# Altium schematic sheet lv_io_temp.SchDoc
size A4; Organization: Badgerloop; Address1: 133 Engineering Research; Address2: Building; Address3: Madison, WI 53715
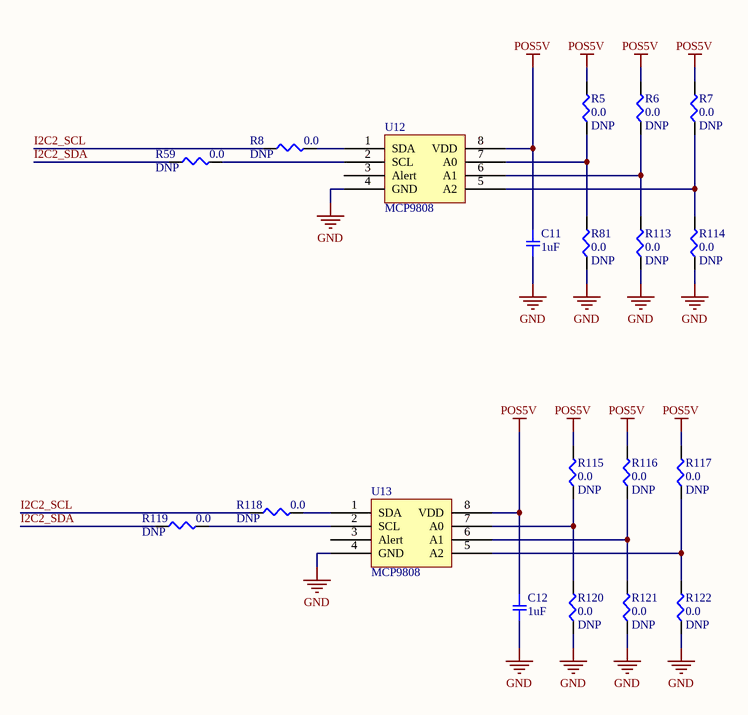
[diagram p0: lv_io_temp.SchDoc]

## Parts
C11  1uF  [SMD-0402C]
C12  1uF  [SMD-0402C]
R5  0.0  [SMD-0402-RES]
R6  0.0  [SMD-0402-RES]
R7  0.0  [SMD-0402-RES]
R8  0.0  [SMD-0402-RES]
R59  0.0  [SMD-0402-RES]
R81  0.0  [SMD-0402-RES]
R113  0.0  [SMD-0402-RES]
R114  0.0  [SMD-0402-RES]
R115  0.0  [SMD-0402-RES]
R116  0.0  [SMD-0402-RES]
R117  0.0  [SMD-0402-RES]
R118  0.0  [SMD-0402-RES]
R119  0.0  [SMD-0402-RES]
R120  0.0  [SMD-0402-RES]
R121  0.0  [SMD-0402-RES]
R122  0.0  [SMD-0402-RES]
U12  MCP9808  [TSOP65P490X65_HS-9N]
U13  MCP9808  [TSOP65P490X65_HS-9N]

## Nets
GND: C11.2 C12.2 R81.1 R113.1 R114.1 R120.1 R121.1 R122.1 U12.4(GND) U13.4(GND)
POS5V: C11.1 C12.1 R5.2 R6.2 R7.2 R115.2 R116.2 R117.2 U12.8(VDD) U13.8(VDD)
I2C2_SCL: R8.1 R118.1
I2C2_SDA: R59.1 R119.1
NetR5_1: R5.1 R81.2 U12.7(A0)
NetR6_1: R6.1 R113.2 U12.6(A1)
NetR7_1: R7.1 R114.2 U12.5(A2)
NetR8_2: R8.2 U12.1(SDA)
NetR59_2: R59.2 U12.2(SCL)
NetR115_1: R115.1 R120.2 U13.7(A0)
NetR116_1: R116.1 R121.2 U13.6(A1)
NetR117_1: R117.1 R122.2 U13.5(A2)
NetR118_2: R118.2 U13.1(SDA)
NetR119_2: R119.2 U13.2(SCL)

Not connected (* = marked no-connect by the designer): U12 3(Alert); U13 3(Alert)

## Notes on the sheet
- Title
- Size:
- Date:
- A4
- Number:
- Time:
- Revision:
- Sheet
- of
- File:

## Library data of the parts
C11 C12 = CAP CER 1uF 100V X7R 0402: C3216X7R2A105K160AM; Manufacturer: TDK; Factory Stock: 0; Unit Price (USD): 0.6; Minimum Quantity: 1; Tolerance: ±10%; Voltage: 100V; Temperature Coefficient: X7R; Datasheets: https://product.tdk.com/en/search/capacitor/ceramic/mlcc/info?part_no=C3216X7R2A105K160AM; Image: //media.digikey.com/Renders/Murata%20Renders/ZRB-SERIES-0402.jpg; Digi-Key Part Number: 445-6073-1-ND; Part Number: https://product.tdk.com/en/search/capacitor/ceramic/mlcc/info?part_no=C3216X7R2A105K160AM; Quantity Available: 0; Packaging: Cut Tape (CT); Part Status: Active; Value: 1uF; Operating Temperature: -55°C ~ 125°C; Applications: General Purpose; Mounting Type: Surface Mount, MLCC; Package / Case: 0402; Size / Dimension: 0.039" L x 0.020" W (1.00mm x 0.50mm); Thickness (Max): 0.022" (0.55mm); Lead Spacing: -; Lead Style: -
R5-R8 R59 R81 R113-R122 = ERJ-2GE0R00X: RES SMD 0.0OHM JUMPER 1/10W 0402; Manufacturer: Panasonic Electronic Components; Factory Stock: 0; Unit Price (USD): 0.00384; @ qty: 1500; Minimum Quantity: 1; Power (Watts): 0.1W, 1/10W; Part Number: ERJ-2GE0R00X; Datasheets: http://industrial.panasonic.com/www-cgi/jvcr13pz.cgi?E+PZ+3+AOA0001+ERJ2GE0R00X+7+WW; Image: //media.digikey.com/Photos/Panasonic%20Photos/ERJ-PA2-Series.jpg; Digi-Key Part Number: P0.0JCT-ND; Quantity Available: 3152483; Packaging: Cut Tape (CT); Series: ERJ; Part Status: Active; Value: 0.0; Tolerance: Jumper; Composition: Thick Film; Features: Automotive AEC-Q200; Temperature Coefficient: -; Operating Temperature: -55°C ~ 155°C; Package / Case: 0402 (1005 Metric); Supplier Device Package: 0402; Size / Dimension: 0.039" L x 0.020" W (1.00mm x 0.50mm); Height - Seated (Max): 0.016" (0.40mm); Number of Terminations: 2; Failure Rate: -; DNP: DNP
U12 U13 = MCP9808: Datasheet Link: http://ww1.microchip.com/downloads/en/DeviceDoc/MCP9808-0.5C-Maximum-Accuracy-Digital-Temperature-Sensor-Data-Sheet-DS20005095B.pdf; Manufacturer P/N: MCP9808; Digikey Link: https://www.digikey.com/product-detail/en/microchip-technology/MCP9808-E-MS/MCP9808-E-MS-ND/2802083; Digikey P/N: MCP9808-E/MS-ND